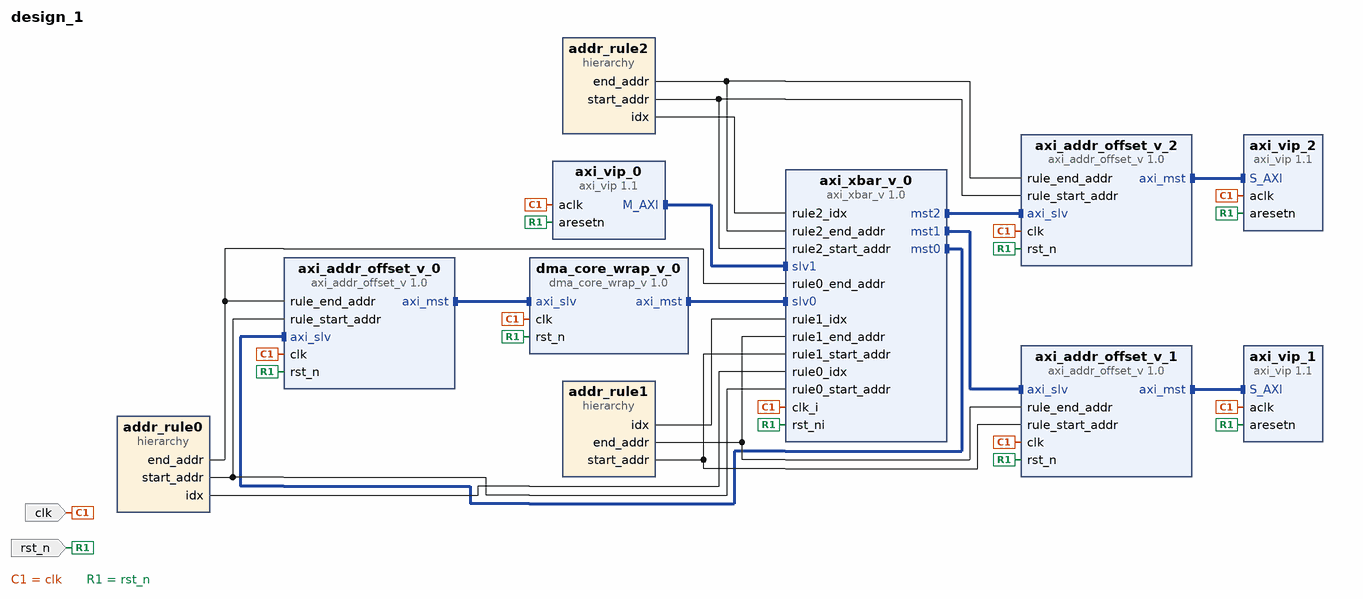
[diagram p0: block diagram of the top level]
# Vivado block design design_1, xczu19eg-ffvc1760-2-i, Vivado 2024.2
create_bd_design design_1

create_bd_port -dir I clk
create_bd_port -dir I rst_n

create_bd_cell -type ip -vlnv user.org:user:axi_xbar_v:1.0 axi_xbar_v_0
set_property -dict [list \
  CONFIG.AxiAddrWidth 0x00000040 \
  CONFIG.AxiMstIdWidth {"00000000000000000000000000000101"} \
  CONFIG.AxiSlvIdWidth 0x00000003 \
  CONFIG.Connectivity 0x00000001 \
  CONFIG.LatencyMode {"1001010010"} \
  CONFIG.NoSlvPorts 0x00000003 \
  CONFIG.UniqueIds {"0"} \
] [get_bd_cells axi_xbar_v_0]
create_bd_cell -type ip -vlnv user.org:user:dma_core_wrap_v:1.0 dma_core_wrap_v_0
set_property -dict {CONFIG.AxiIdWidth 0x00000008 CONFIG.AxiSlvIdWidth 0x00000008} [get_bd_cells dma_core_wrap_v_0]
create_bd_cell -type ip -vlnv xilinx.com:ip:axi_vip:1.1 axi_vip_0
set_property -dict [list \
  CONFIG.ADDR_WIDTH 64 \
  CONFIG.ARUSER_WIDTH 0 \
  CONFIG.AWUSER_WIDTH 0 \
  CONFIG.BUSER_WIDTH 0 \
  CONFIG.DATA_WIDTH 64 \
  CONFIG.HAS_BRESP 1 \
  CONFIG.HAS_BURST 1 \
  CONFIG.HAS_CACHE 1 \
  CONFIG.HAS_LOCK 1 \
  CONFIG.HAS_PROT 1 \
  CONFIG.HAS_QOS 1 \
  CONFIG.HAS_REGION 1 \
  CONFIG.HAS_RRESP 1 \
  CONFIG.HAS_WSTRB 1 \
  CONFIG.ID_WIDTH 0 \
  CONFIG.INTERFACE_MODE MASTER \
  CONFIG.PROTOCOL AXI4 \
  CONFIG.READ_WRITE_MODE READ_WRITE \
  CONFIG.RUSER_WIDTH 0 \
  CONFIG.SUPPORTS_NARROW 1 \
  CONFIG.WUSER_WIDTH 0 \
] [get_bd_cells axi_vip_0]
create_bd_cell -type ip -vlnv xilinx.com:ip:axi_vip:1.1 axi_vip_1
set_property -dict {CONFIG.ADDR_WIDTH 64 CONFIG.DATA_WIDTH 64 CONFIG.INTERFACE_MODE SLAVE} [get_bd_cells axi_vip_1]
create_bd_cell -type ip -vlnv xilinx.com:ip:axi_vip:1.1 axi_vip_2
set_property -dict {CONFIG.ADDR_WIDTH 64 CONFIG.DATA_WIDTH 64 CONFIG.INTERFACE_MODE SLAVE} [get_bd_cells axi_vip_2]
create_bd_cell -type hier addr_rule0
create_bd_cell -type hier addr_rule1
create_bd_cell -type hier addr_rule2
create_bd_cell -type ip -vlnv user.org:user:axi_addr_offset_v:1.0 axi_addr_offset_v_0
set_property -dict {CONFIG.AxiIdWidth 0x00000008} [get_bd_cells axi_addr_offset_v_0]
create_bd_cell -type ip -vlnv user.org:user:axi_addr_offset_v:1.0 axi_addr_offset_v_1
set_property -dict {CONFIG.AxiIdWidth 0x00000008} [get_bd_cells axi_addr_offset_v_1]
create_bd_cell -type ip -vlnv user.org:user:axi_addr_offset_v:1.0 axi_addr_offset_v_2
set_property -dict {CONFIG.AxiIdWidth 0x00000008} [get_bd_cells axi_addr_offset_v_2]

# ---- hierarchy /addr_rule0 ----
current_bd_instance /addr_rule0
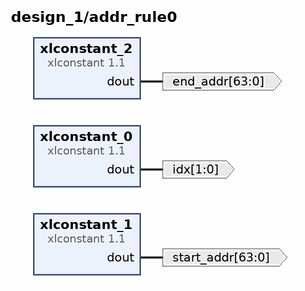
[diagram p1: block diagram inside /addr_rule0]
create_bd_pin -dir O -from 1 -to 0 idx
create_bd_pin -dir O -from 63 -to 0 start_addr
create_bd_pin -dir O -from 63 -to 0 end_addr

create_bd_cell -type ip -vlnv xilinx.com:ip:xlconstant:1.1 xlconstant_0
set_property -dict {CONFIG.CONST_VAL 0 CONFIG.CONST_WIDTH 2} [get_bd_cells xlconstant_0]
create_bd_cell -type ip -vlnv xilinx.com:ip:xlconstant:1.1 xlconstant_1
set_property -dict {CONFIG.CONST_VAL 0x80000000 CONFIG.CONST_WIDTH 64} [get_bd_cells xlconstant_1]
create_bd_cell -type ip -vlnv xilinx.com:ip:xlconstant:1.1 xlconstant_2
set_property -dict {CONFIG.CONST_VAL 0x8000FFFF CONFIG.CONST_WIDTH 64} [get_bd_cells xlconstant_2]

# ---- hierarchy /addr_rule1 ----
current_bd_instance /addr_rule1
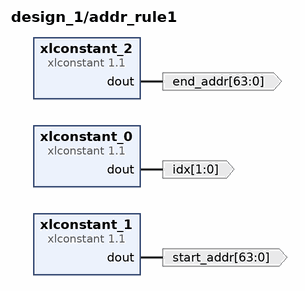
[diagram p2: block diagram inside /addr_rule1]
create_bd_pin -dir O -from 1 -to 0 idx
create_bd_pin -dir O -from 63 -to 0 start_addr
create_bd_pin -dir O -from 63 -to 0 end_addr

create_bd_cell -type ip -vlnv xilinx.com:ip:xlconstant:1.1 xlconstant_0
set_property -dict {CONFIG.CONST_VAL 1 CONFIG.CONST_WIDTH 2} [get_bd_cells xlconstant_0]
create_bd_cell -type ip -vlnv xilinx.com:ip:xlconstant:1.1 xlconstant_1
set_property -dict {CONFIG.CONST_VAL 0x20000000 CONFIG.CONST_WIDTH 64} [get_bd_cells xlconstant_1]
create_bd_cell -type ip -vlnv xilinx.com:ip:xlconstant:1.1 xlconstant_2
set_property -dict {CONFIG.CONST_VAL 0x40000000 CONFIG.CONST_WIDTH 64} [get_bd_cells xlconstant_2]

# ---- hierarchy /addr_rule2 ----
current_bd_instance /addr_rule2
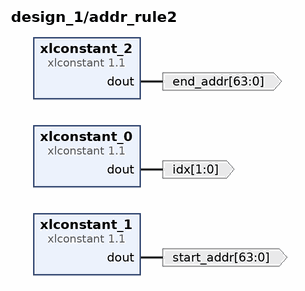
[diagram p3: block diagram inside /addr_rule2]
create_bd_pin -dir O -from 1 -to 0 idx
create_bd_pin -dir O -from 63 -to 0 start_addr
create_bd_pin -dir O -from 63 -to 0 end_addr

create_bd_cell -type ip -vlnv xilinx.com:ip:xlconstant:1.1 xlconstant_0
set_property -dict {CONFIG.CONST_VAL 2 CONFIG.CONST_WIDTH 2} [get_bd_cells xlconstant_0]
create_bd_cell -type ip -vlnv xilinx.com:ip:xlconstant:1.1 xlconstant_1
set_property -dict {CONFIG.CONST_VAL 0x82000000 CONFIG.CONST_WIDTH 64} [get_bd_cells xlconstant_1]
create_bd_cell -type ip -vlnv xilinx.com:ip:xlconstant:1.1 xlconstant_2
set_property -dict {CONFIG.CONST_VAL 0x8201FFFF CONFIG.CONST_WIDTH 64} [get_bd_cells xlconstant_2]

# ---- connections ----

current_bd_instance /addr_rule0
connect_bd_net [get_bd_pins xlconstant_0/dout] [get_bd_pins idx]
connect_bd_net [get_bd_pins xlconstant_1/dout] [get_bd_pins start_addr]
connect_bd_net [get_bd_pins xlconstant_2/dout] [get_bd_pins end_addr]

current_bd_instance /addr_rule1
connect_bd_net [get_bd_pins xlconstant_0/dout] [get_bd_pins idx]
connect_bd_net [get_bd_pins xlconstant_1/dout] [get_bd_pins start_addr]
connect_bd_net [get_bd_pins xlconstant_2/dout] [get_bd_pins end_addr]

current_bd_instance /addr_rule2
connect_bd_net [get_bd_pins xlconstant_0/dout] [get_bd_pins idx]
connect_bd_net [get_bd_pins xlconstant_1/dout] [get_bd_pins start_addr]
connect_bd_net [get_bd_pins xlconstant_2/dout] [get_bd_pins end_addr]

current_bd_instance /
connect_bd_intf_net [get_bd_intf_pins axi_addr_offset_v_0/axi_mst] [get_bd_intf_pins dma_core_wrap_v_0/axi_slv]
connect_bd_intf_net [get_bd_intf_pins axi_addr_offset_v_1/axi_mst] [get_bd_intf_pins axi_vip_1/S_AXI]
connect_bd_intf_net [get_bd_intf_pins axi_addr_offset_v_2/axi_mst] [get_bd_intf_pins axi_vip_2/S_AXI]
connect_bd_intf_net [get_bd_intf_pins axi_vip_0/M_AXI] [get_bd_intf_pins axi_xbar_v_0/slv1]
connect_bd_intf_net [get_bd_intf_pins axi_xbar_v_0/mst0] [get_bd_intf_pins axi_addr_offset_v_0/axi_slv]
connect_bd_intf_net [get_bd_intf_pins axi_xbar_v_0/mst1] [get_bd_intf_pins axi_addr_offset_v_1/axi_slv]
connect_bd_intf_net [get_bd_intf_pins axi_xbar_v_0/mst2] [get_bd_intf_pins axi_addr_offset_v_2/axi_slv]
connect_bd_intf_net [get_bd_intf_pins dma_core_wrap_v_0/axi_mst] [get_bd_intf_pins axi_xbar_v_0/slv0]
connect_bd_net [get_bd_pins addr_rule0/end_addr] [get_bd_pins axi_addr_offset_v_0/rule_end_addr] [get_bd_pins axi_xbar_v_0/rule0_end_addr]
connect_bd_net [get_bd_pins addr_rule0/idx] [get_bd_pins axi_xbar_v_0/rule0_idx]
connect_bd_net [get_bd_pins addr_rule0/start_addr] [get_bd_pins axi_addr_offset_v_0/rule_start_addr] [get_bd_pins axi_xbar_v_0/rule0_start_addr]
connect_bd_net [get_bd_pins addr_rule1/end_addr] [get_bd_pins axi_addr_offset_v_1/rule_end_addr] [get_bd_pins axi_xbar_v_0/rule1_end_addr]
connect_bd_net [get_bd_pins addr_rule1/idx] [get_bd_pins axi_xbar_v_0/rule1_idx]
connect_bd_net [get_bd_pins addr_rule1/start_addr] [get_bd_pins axi_addr_offset_v_1/rule_start_addr] [get_bd_pins axi_xbar_v_0/rule1_start_addr]
connect_bd_net [get_bd_pins addr_rule2/end_addr] [get_bd_pins axi_addr_offset_v_2/rule_end_addr] [get_bd_pins axi_xbar_v_0/rule2_end_addr]
connect_bd_net [get_bd_pins addr_rule2/idx] [get_bd_pins axi_xbar_v_0/rule2_idx]
connect_bd_net [get_bd_pins addr_rule2/start_addr] [get_bd_pins axi_addr_offset_v_2/rule_start_addr] [get_bd_pins axi_xbar_v_0/rule2_start_addr]
connect_bd_net [get_bd_ports clk] \
  [get_bd_pins dma_core_wrap_v_0/clk] [get_bd_pins axi_vip_0/aclk] [get_bd_pins axi_vip_1/aclk] [get_bd_pins axi_vip_2/aclk] \
  [get_bd_pins axi_addr_offset_v_0/clk] [get_bd_pins axi_addr_offset_v_1/clk] [get_bd_pins axi_addr_offset_v_2/clk] \
  [get_bd_pins axi_xbar_v_0/clk_i]
connect_bd_net [get_bd_ports rst_n] \
  [get_bd_pins axi_vip_0/aresetn] [get_bd_pins dma_core_wrap_v_0/rst_n] [get_bd_pins axi_vip_1/aresetn] \
  [get_bd_pins axi_vip_2/aresetn] [get_bd_pins axi_addr_offset_v_0/rst_n] [get_bd_pins axi_addr_offset_v_1/rst_n] \
  [get_bd_pins axi_addr_offset_v_2/rst_n] [get_bd_pins axi_xbar_v_0/rst_ni]

# ---- address map ----
exclude_bd_addr_seg -offset 0x0000000044A00000 -range 64K -target_address_space [get_bd_addr_spaces axi_vip_0/Master_AXI] [get_bd_addr_segs axi_xbar_v_0/slv1/Reg]
exclude_bd_addr_seg -offset 0x0000000044A00000 -range 64K -target_address_space [get_bd_addr_spaces dma_core_wrap_v_0/axi_mst] [get_bd_addr_segs axi_xbar_v_0/slv0/Reg]

validate_bd_design
save_bd_design
